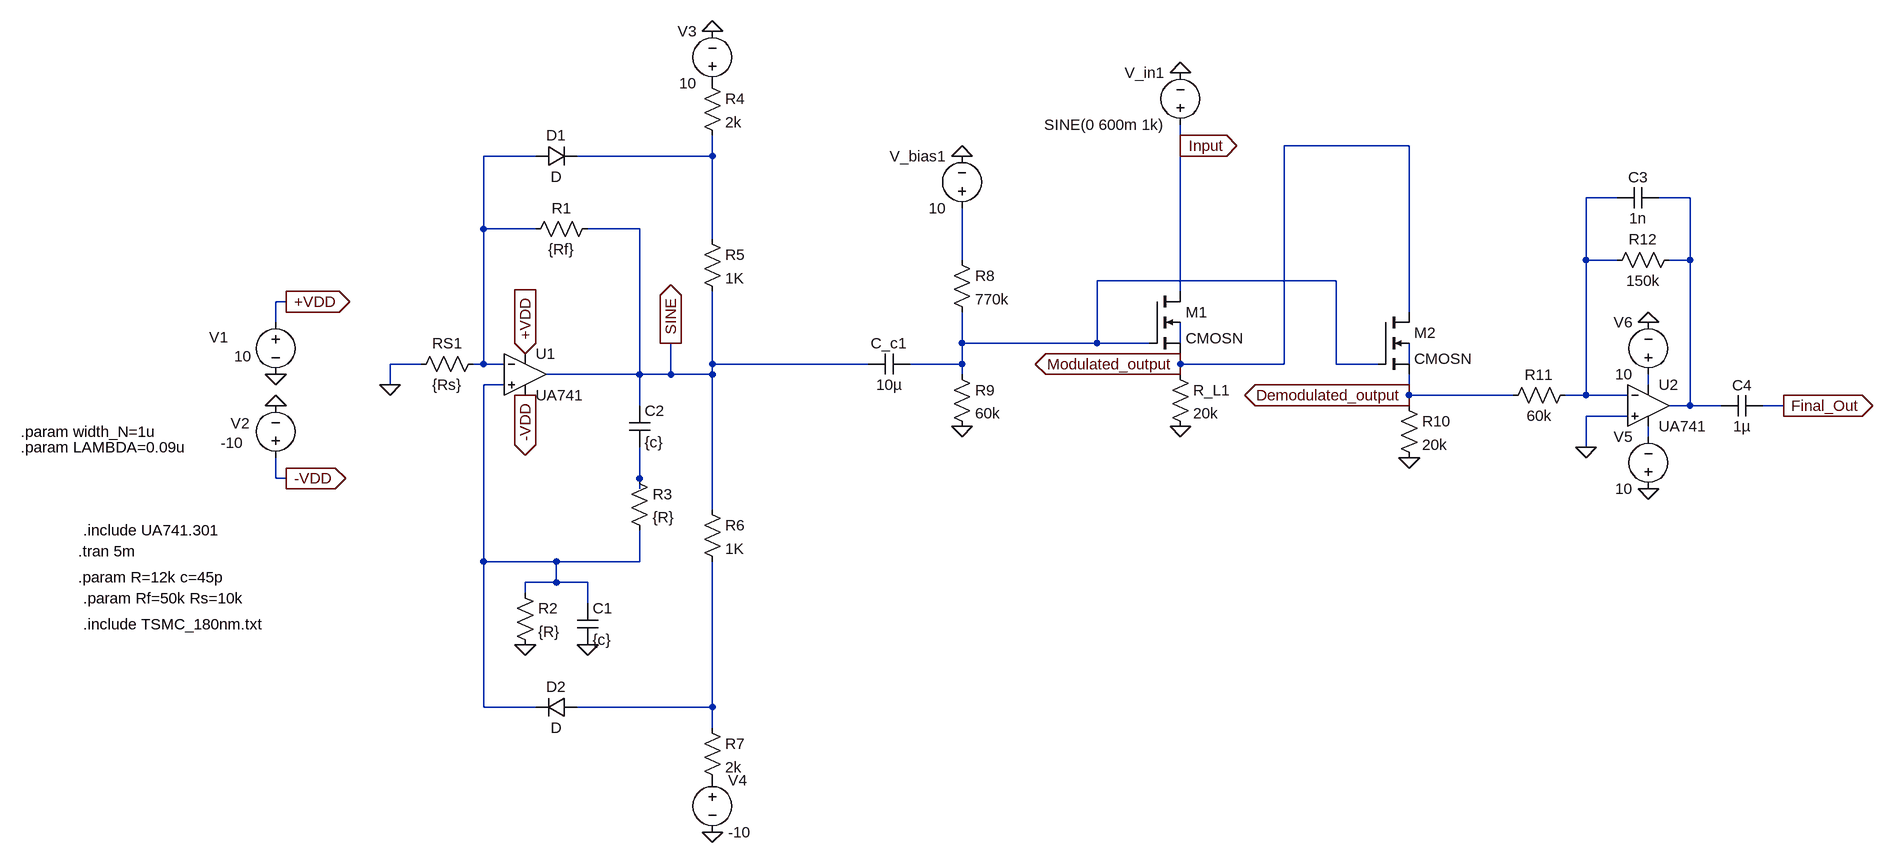
[diagram p0: schematic Updated_full_circuit.asc]
Updated_full_circuit.asc, the LTspice schematic file:
Version 4
SHEET 1 2492 884
WIRE 1360 -192 1360 -224
WIRE 1712 -192 1520 -192
WIRE 368 -176 288 -176
WIRE 640 -176 640 -208
WIRE 640 -176 432 -176
WIRE 2032 -112 1984 -112
WIRE 2144 -112 2096 -112
WIRE 288 -64 288 -176
WIRE 368 -64 288 -64
WIRE 528 -64 448 -64
WIRE 640 -48 640 -176
WIRE 1024 -16 1024 -96
WIRE 1984 -16 1984 -112
WIRE 2032 -16 1984 -16
WIRE 2144 -16 2144 -112
WIRE 2144 -16 2112 -16
WIRE 1600 16 1232 16
WIRE 1360 32 1360 -192
WIRE -16 48 -32 48
WIRE 1712 64 1712 -192
WIRE -32 80 -32 48
WIRE 1024 112 1024 64
WIRE 1232 112 1232 16
WIRE 1232 112 1024 112
WIRE 1312 112 1232 112
WIRE 1360 112 1360 80
WIRE 192 144 144 144
WIRE 288 144 288 -64
WIRE 288 144 272 144
WIRE 320 144 288 144
WIRE 640 144 640 32
WIRE 880 144 640 144
WIRE 1024 144 1024 112
WIRE 1024 144 944 144
WIRE 1360 144 1360 128
WIRE 1520 144 1520 -192
WIRE 1520 144 1360 144
WIRE 1600 144 1600 16
WIRE 1664 144 1600 144
WIRE 1712 144 1712 112
WIRE 528 160 528 -64
WIRE 528 160 384 160
WIRE 576 160 576 112
WIRE 576 160 528 160
WIRE 640 160 640 144
WIRE 640 160 576 160
WIRE 1024 160 1024 144
WIRE 1360 160 1360 144
WIRE 144 176 144 144
WIRE 320 176 288 176
WIRE 2080 176 2080 160
WIRE 1712 192 1712 160
WIRE 1872 192 1712 192
WIRE 1984 192 1984 -16
WIRE 1984 192 1952 192
WIRE 2048 192 1984 192
WIRE 528 208 528 160
WIRE 1712 208 1712 192
WIRE 2144 208 2144 -16
WIRE 2144 208 2112 208
WIRE 2192 208 2144 208
WIRE 2288 208 2256 208
WIRE 2048 224 1984 224
WIRE 2080 256 2080 240
WIRE 1984 272 1984 224
WIRE -32 320 -32 288
WIRE -16 320 -32 320
WIRE 528 320 528 272
WIRE 528 336 528 320
WIRE 640 368 640 160
WIRE 288 448 288 176
WIRE 400 448 288 448
WIRE 528 448 528 400
WIRE 528 448 400 448
WIRE 400 480 400 448
WIRE 400 480 352 480
WIRE 448 480 400 480
WIRE 352 496 352 480
WIRE 448 512 448 480
WIRE 288 672 288 448
WIRE 368 672 288 672
WIRE 640 672 640 448
WIRE 640 672 432 672
WIRE 640 704 640 672
FLAG -32 160 0
FLAG -32 208 0
FLAG -16 48 +VDD
IOPIN -16 48 Out
FLAG -16 320 -VDD
IOPIN -16 320 Out
FLAG 352 128 +VDD
IOPIN 352 128 In
FLAG 352 192 -VDD
IOPIN 352 192 Out
FLAG 144 176 0
FLAG 352 576 0
FLAG 448 576 0
FLAG 576 112 SINE
IOPIN 576 112 Out
FLAG 640 864 0
FLAG 640 -368 0
FLAG 1024 240 0
FLAG 1024 -176 0
FLAG 1360 -304 0
FLAG 1360 240 0
FLAG 1712 288 0
FLAG 2080 336 0
FLAG 2080 80 0
FLAG 1360 -192 Input
IOPIN 1360 -192 Out
FLAG 1360 144 Modulated_output
IOPIN 1360 144 Out
FLAG 2288 208 Final_Out
IOPIN 2288 208 Out
FLAG 1712 192 Demodulated_output
IOPIN 1712 192 Out
FLAG 1984 272 0
DATAFLAG 640 -176 ""
DATAFLAG 640 688 ""
DATAFLAG 1360 0 ""
DATAFLAG 1216 112 ""
DATAFLAG 1392 144 ""
DATAFLAG 1808 192 ""
DATAFLAG 1712 32 ""
DATAFLAG 1568 16 ""
SYMBOL voltage -32 64 R0
WINDOW 0 -102 39 Left 2
WINDOW 3 -64 68 Left 2
WINDOW 123 0 0 Left 0
WINDOW 39 0 0 Left 0
SYMATTR InstName V1
SYMATTR Value 10
SYMBOL voltage -32 304 R180
WINDOW 0 40 69 Left 2
WINDOW 3 49 39 Left 2
WINDOW 123 0 0 Left 0
WINDOW 39 0 0 Left 0
SYMATTR InstName V2
SYMATTR Value -10
SYMBOL OpAmps\\opamp2 352 96 R0
SYMATTR InstName U1
SYMATTR Value UA741
SYMBOL res 288 128 R90
WINDOW 0 0 56 VBottom 2
WINDOW 3 32 56 VTop 2
SYMATTR InstName RS1
SYMATTR Value {Rs}
SYMBOL res 464 -80 R90
WINDOW 0 0 56 VBottom 2
WINDOW 3 32 56 VTop 2
SYMATTR InstName R1
SYMATTR Value {Rf}
SYMBOL res 336 480 R0
SYMATTR InstName R2
SYMATTR Value {R}
SYMBOL cap 432 512 R0
SYMATTR InstName C1
SYMATTR Value {c}
SYMBOL res 512 304 R0
SYMATTR InstName R3
SYMATTR Value {R}
SYMBOL cap 512 208 R0
SYMATTR InstName C2
SYMATTR Value {c}
SYMBOL diode 368 -160 R270
WINDOW 0 32 32 VTop 2
WINDOW 3 0 32 VBottom 2
SYMATTR InstName D1
SYMBOL diode 432 656 R90
WINDOW 0 0 32 VBottom 2
WINDOW 3 32 32 VTop 2
SYMATTR InstName D2
SYMBOL res 624 -304 R0
SYMATTR InstName R4
SYMATTR Value 2k
SYMBOL res 624 -64 R0
SYMATTR InstName R5
SYMATTR Value 1K
SYMBOL res 624 352 R0
SYMATTR InstName R6
SYMATTR Value 1K
SYMBOL res 624 688 R0
SYMATTR InstName R7
SYMATTR Value 2k
SYMBOL voltage 640 -272 R180
WINDOW 0 24 96 Left 2
WINDOW 3 24 16 Left 2
WINDOW 123 0 0 Left 0
WINDOW 39 0 0 Left 0
SYMATTR InstName V3
SYMATTR Value 10
SYMBOL voltage 640 768 R0
WINDOW 123 0 0 Left 0
WINDOW 39 0 0 Left 0
SYMATTR InstName V4
SYMATTR Value -10
SYMBOL nmos4 1312 32 R0
SYMATTR InstName M1
SYMATTR Value CMOSN
SYMATTR Value2 l={2*LAMBDA} w={width_N} ad={5*width_ N*LAMBDA} as={5*width_ N*LAMBDA} pd={10*LAMBDA+2*width_N} ps={10*LAMBDA+2*width_N}
SYMBOL res 1008 -32 R0
SYMATTR InstName R8
SYMATTR Value 770k
SYMBOL res 1008 144 R0
SYMATTR InstName R9
SYMATTR Value 60k
SYMBOL cap 944 128 R90
WINDOW 0 0 32 VBottom 2
WINDOW 3 32 32 VTop 2
SYMATTR InstName C_c1
SYMATTR Value 10µ
SYMBOL voltage 1024 -80 R180
WINDOW 0 24 96 Left 2
WINDOW 3 24 16 Left 2
SYMATTR InstName V_bias1
SYMATTR Value 10
SYMBOL voltage 1360 -208 R180
WINDOW 0 24 96 Left 2
WINDOW 3 24 16 Left 2
WINDOW 123 0 0 Left 0
WINDOW 39 0 0 Left 0
SYMATTR InstName V_in1
SYMATTR Value SINE(0 600m 1k)
SYMBOL res 1344 144 R0
SYMATTR InstName R_L1
SYMATTR Value 20k
SYMBOL nmos4 1664 64 R0
SYMATTR InstName M2
SYMATTR Value CMOSN
SYMATTR Value2 l={2*LAMBDA} w={width_N} ad={5*width_ N*LAMBDA} as={5*width_ N*LAMBDA} pd={10*LAMBDA+2*width_N} ps={10*LAMBDA+2*width_N}
SYMBOL res 1696 192 R0
SYMATTR InstName R10
SYMATTR Value 20k
SYMBOL OpAmps\\opamp2 2080 144 R0
SYMATTR InstName U2
SYMATTR Value UA741
SYMBOL voltage 2080 352 R180
WINDOW 0 24 96 Left 2
WINDOW 3 24 16 Left 2
WINDOW 123 0 0 Left 0
WINDOW 39 0 0 Left 0
SYMATTR InstName V5
SYMATTR Value 10
SYMBOL voltage 2080 176 R180
WINDOW 0 24 96 Left 2
WINDOW 3 24 16 Left 2
WINDOW 123 0 0 Left 0
WINDOW 39 0 0 Left 0
SYMATTR InstName V6
SYMATTR Value 10
SYMBOL res 1968 176 R90
WINDOW 0 0 56 VBottom 2
WINDOW 3 32 56 VTop 2
SYMATTR InstName R11
SYMATTR Value 60k
SYMBOL res 2128 -32 R90
WINDOW 0 0 56 VBottom 2
WINDOW 3 32 56 VTop 2
SYMATTR InstName R12
SYMATTR Value 150k
SYMBOL cap 2096 -128 R90
WINDOW 0 0 32 VBottom 2
WINDOW 3 32 32 VTop 2
SYMATTR InstName C3
SYMATTR Value 1n
SYMBOL cap 2256 192 R90
WINDOW 0 0 32 VBottom 2
WINDOW 3 32 32 VTop 2
SYMATTR InstName C4
SYMATTR Value 1µ
TEXT -328 544 Left 2 !.include TSMC_180nm.txt
TEXT -336 432 Left 2 !.tran 5m
TEXT -336 472 Left 2 !.param R=12k c=45p
TEXT -328 504 Left 2 !.param Rf=50k Rs=10k
TEXT -328 400 Left 2 !.include UA741.301
TEXT -424 248 Left 2 !.param width_N=1u
TEXT -424 272 Left 2 !.param LAMBDA=0.09u

The netlist it stands for:
* Updated_full_circuit.asc
V1 +VDD 0 10
V2 -VDD 0 -10
XU1 N009 N001 +VDD -VDD SINE UA741  ; pins In+ In- V+ V- OUT
RS1 N001 0 {Rs}
R1 SINE N001 {Rf}
R2 N009 0 {R}
C1 N009 0 {c}
R3 N012 N009 {R}
C2 SINE N012 {c}
D1 N001 N002 D
D2 N013 N009 D
R4 P001 N002 2k
R5 N002 SINE 1K
R6 SINE N013 1K
R7 N013 P002 2k
V3 P001 0 10
V4 P002 0 -10
M1 Input N006 Modulated_output N007 CMOSN l={2*LAMBDA} w={width_N} ad={5*width_ N*LAMBDA} as={5*width_ N*LAMBDA} pd={10*LAMBDA+2*width_N} ps={10*LAMBDA+2*width_N}
R8 N005 N006 770k
R9 N006 0 60k
C_c1 N006 SINE 10µ
V_bias1 N005 0 10
V_in1 Input 0 SINE(0 600m 1k)
R_L1 Modulated_output 0 20k
M2 Modulated_output N006 Demodulated_output N008 CMOSN l={2*LAMBDA} w={width_N} ad={5*width_ N*LAMBDA} as={5*width_ N*LAMBDA} pd={10*LAMBDA+2*width_N} ps={10*LAMBDA+2*width_N}
R10 Demodulated_output 0 20k
XU2 0 N003 N010 N011 N004 UA741  ; pins In+ In- V+ V- OUT
V5 0 N011 10
V6 N010 0 10
R11 N003 Demodulated_output 60k
R12 N004 N003 150k
C3 N004 N003 1n
C4 Final_Out N004 1µ
.model D D
.lib standard.dio
.model NMOS NMOS
.model PMOS PMOS
.lib standard.mos
.include TSMC_180nm.txt
.tran 5m
.param R=12k c=45p
.param Rf=50k Rs=10k
.include UA741.301
.param width_N=1u
.param LAMBDA=0.09u
.backanno
.end